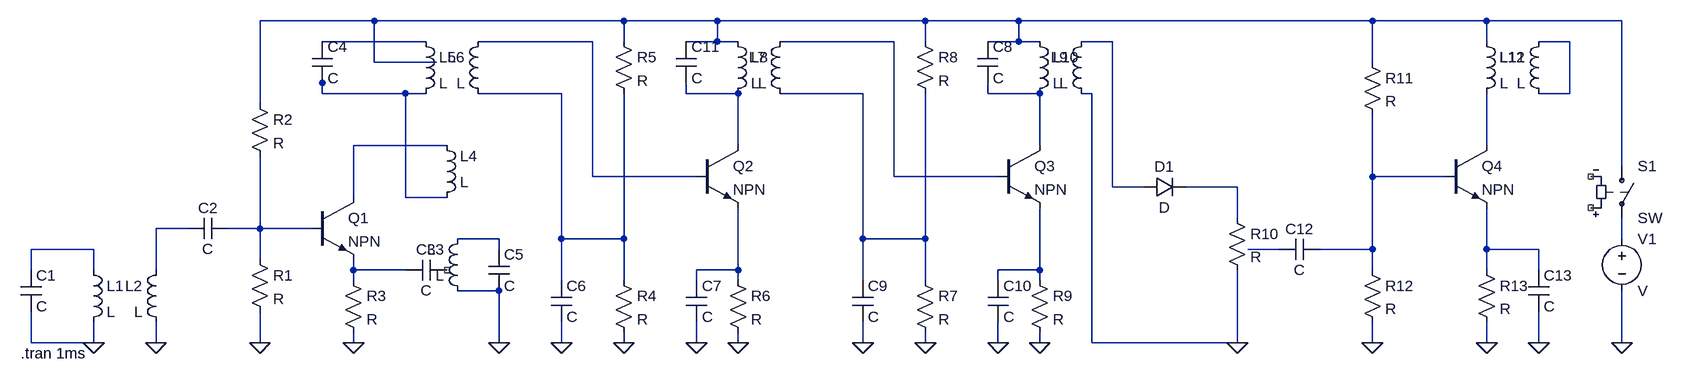
[diagram p0: schematic Superheterodyne Receiver Simulation.asc]
Superheterodyne Receiver Simulation.asc, the LTspice schematic file:
Version 4
SHEET 1 2528 680
WIRE 544 -304 368 -304
WIRE 928 -304 544 -304
WIRE 1072 -304 928 -304
WIRE 1392 -304 1072 -304
WIRE 1536 -304 1392 -304
WIRE 2080 -304 1536 -304
WIRE 2256 -304 2080 -304
WIRE 2464 -304 2256 -304
WIRE 624 -272 464 -272
WIRE 880 -272 704 -272
WIRE 928 -272 928 -304
WIRE 1072 -272 1072 -304
WIRE 1072 -272 1024 -272
WIRE 1104 -272 1072 -272
WIRE 1344 -272 1168 -272
WIRE 1392 -272 1392 -304
WIRE 1536 -272 1536 -304
WIRE 1536 -272 1488 -272
WIRE 1568 -272 1536 -272
WIRE 1680 -272 1632 -272
WIRE 2256 -272 2256 -304
WIRE 2384 -272 2336 -272
WIRE 544 -240 544 -304
WIRE 640 -240 544 -240
WIRE 2080 -240 2080 -304
WIRE 464 -208 464 -224
WIRE 464 -192 464 -208
WIRE 592 -192 464 -192
WIRE 624 -192 592 -192
WIRE 832 -192 704 -192
WIRE 1024 -192 1024 -208
WIRE 1104 -192 1024 -192
WIRE 1296 -192 1168 -192
WIRE 1488 -192 1488 -208
WIRE 1568 -192 1488 -192
WIRE 1648 -192 1632 -192
WIRE 2384 -192 2384 -272
WIRE 2384 -192 2336 -192
WIRE 368 -176 368 -304
WIRE 656 -112 512 -112
WIRE 1104 -112 1104 -192
WIRE 1568 -112 1568 -192
WIRE 2256 -112 2256 -192
WIRE 2464 -80 2464 -304
WIRE 880 -64 880 -272
WIRE 1040 -64 880 -64
WIRE 1344 -64 1344 -272
WIRE 1504 -64 1344 -64
WIRE 2080 -64 2080 -160
WIRE 2192 -64 2080 -64
WIRE 1680 -48 1680 -272
WIRE 1728 -48 1680 -48
WIRE 1872 -48 1792 -48
WIRE 512 -32 512 -112
WIRE 592 -32 592 -192
WIRE 656 -32 592 -32
WIRE 1872 0 1872 -48
WIRE 256 16 208 16
WIRE 368 16 368 -96
WIRE 368 16 320 16
WIRE 448 16 368 16
WIRE 736 32 672 32
WIRE 832 32 832 -192
WIRE 928 32 928 -192
WIRE 928 32 832 32
WIRE 1296 32 1296 -192
WIRE 1392 32 1392 -192
WIRE 1392 32 1296 32
WIRE 2464 32 2464 0
WIRE 112 48 16 48
WIRE 736 48 736 32
WIRE 1936 48 1888 48
WIRE 2080 48 2080 -64
WIRE 2080 48 2000 48
WIRE 2256 48 2256 -16
WIRE 2336 48 2256 48
WIRE 368 64 368 16
WIRE 16 80 16 48
WIRE 112 80 112 48
WIRE 208 80 208 16
WIRE 512 80 512 64
WIRE 592 80 512 80
WIRE 1104 80 1104 -16
WIRE 1104 80 1040 80
WIRE 1568 80 1568 -16
WIRE 1568 80 1504 80
WIRE 2080 80 2080 48
WIRE 2256 80 2256 48
WIRE 2336 80 2336 48
WIRE 512 96 512 80
WIRE 832 96 832 32
WIRE 928 96 928 32
WIRE 1040 96 1040 80
WIRE 1104 96 1104 80
WIRE 1296 96 1296 32
WIRE 1392 96 1392 32
WIRE 1504 96 1504 80
WIRE 1568 96 1568 80
WIRE 736 112 672 112
WIRE 16 192 16 144
WIRE 112 192 112 160
WIRE 112 192 16 192
WIRE 208 192 208 160
WIRE 368 192 368 144
WIRE 512 192 512 176
WIRE 736 192 736 112
WIRE 832 192 832 160
WIRE 928 192 928 176
WIRE 1040 192 1040 160
WIRE 1104 192 1104 176
WIRE 1296 192 1296 160
WIRE 1392 192 1392 176
WIRE 1504 192 1504 160
WIRE 1568 192 1568 176
WIRE 1648 192 1648 -192
WIRE 1872 192 1872 80
WIRE 1872 192 1648 192
WIRE 2080 192 2080 160
WIRE 2256 192 2256 160
WIRE 2336 192 2336 144
WIRE 2464 192 2464 112
FLAG 112 192 0
FLAG 208 192 0
FLAG 368 192 0
FLAG 512 192 0
FLAG 736 192 0
FLAG 832 192 0
FLAG 928 192 0
FLAG 1040 192 0
FLAG 1104 192 0
FLAG 1296 192 0
FLAG 1392 192 0
FLAG 1504 192 0
FLAG 1568 192 0
FLAG 1872 192 0
FLAG 2080 192 0
FLAG 2256 192 0
FLAG 2336 192 0
FLAG 2464 192 0
SYMBOL ind 96 64 R0
SYMATTR InstName L1
SYMBOL ind 224 64 M0
SYMATTR InstName L2
SYMBOL cap 0 80 R0
SYMATTR InstName C1
SYMBOL cap 320 0 R90
WINDOW 0 0 32 VBottom 2
WINDOW 3 32 32 VTop 2
SYMATTR InstName C2
SYMBOL res 352 48 R0
SYMATTR InstName R1
SYMBOL res 352 -192 R0
SYMATTR InstName R2
SYMBOL npn 448 -32 R0
SYMATTR InstName Q1
SYMBOL res 496 80 R0
SYMATTR InstName R3
SYMBOL cap 656 64 R90
WINDOW 0 0 32 VBottom 2
WINDOW 3 32 32 VTop 2
SYMATTR InstName C3
SYMBOL ind 688 128 R180
WINDOW 0 36 80 Left 2
WINDOW 3 36 40 Left 2
SYMATTR InstName L3
SYMBOL ind 640 -16 M180
WINDOW 0 36 80 Left 2
WINDOW 3 36 40 Left 2
SYMATTR InstName L4
SYMBOL ind 608 -288 R0
SYMATTR InstName L5
SYMBOL ind 720 -288 M0
SYMATTR InstName L6
SYMBOL cap 448 -272 R0
SYMATTR InstName C4
SYMBOL cap 720 48 R0
SYMATTR InstName C5
SYMBOL cap 816 96 R0
SYMATTR InstName C6
SYMBOL res 912 80 R0
SYMATTR InstName R4
SYMBOL res 912 -288 R0
SYMATTR InstName R5
SYMBOL npn 1040 -112 R0
SYMATTR InstName Q2
SYMBOL res 1088 80 R0
SYMATTR InstName R6
SYMBOL cap 1024 96 R0
SYMATTR InstName C7
SYMBOL ind 1184 -288 M0
SYMATTR InstName L7
SYMBOL cap 1280 96 R0
SYMATTR InstName C9
SYMBOL res 1376 80 R0
SYMATTR InstName R7
SYMBOL res 1376 -288 R0
SYMATTR InstName R8
SYMBOL npn 1504 -112 R0
SYMATTR InstName Q3
SYMBOL res 1552 80 R0
SYMATTR InstName R9
SYMBOL cap 1488 96 R0
SYMATTR InstName C10
SYMBOL ind 1088 -288 R0
SYMATTR InstName L8
SYMBOL cap 1008 -272 R0
SYMATTR InstName C11
SYMBOL ind 1648 -288 M0
SYMATTR InstName L9
SYMBOL ind 1552 -288 R0
SYMATTR InstName L10
SYMBOL cap 1472 -272 R0
SYMATTR InstName C8
SYMBOL diode 1728 -32 R270
WINDOW 0 32 32 VTop 2
WINDOW 3 0 32 VBottom 2
SYMATTR InstName D1
SYMBOL res 1856 -16 R0
SYMATTR InstName R10
SYMBOL cap 2000 32 R90
WINDOW 0 0 32 VBottom 2
WINDOW 3 32 32 VTop 2
SYMATTR InstName C12
SYMBOL res 2064 -256 R0
SYMATTR InstName R11
SYMBOL res 2064 64 R0
SYMATTR InstName R12
SYMBOL npn 2192 -112 R0
SYMATTR InstName Q4
SYMBOL ind 2240 -288 R0
SYMATTR InstName L11
SYMBOL ind 2352 -288 M0
SYMATTR InstName L12
SYMBOL res 2240 64 R0
SYMATTR InstName R13
SYMBOL cap 2320 80 R0
SYMATTR InstName C13
SYMBOL sw 2464 -96 R0
SYMATTR InstName S1
SYMBOL voltage 2464 16 R0
SYMATTR InstName V1
TEXT 0 208 Left 2 !.tran 1ms

The netlist it stands for:
* Superheterodyne Receiver Simulation.asc
L1 N020 0 L
L2 N016 0 L
C1 N020 0 C
C2 N017 N016 C
R1 N017 0 R
R2 N001 N017 R
Q1 N012 N017 N023 0 NPN
R3 N023 0 R
C3 NC_01 N023 C
L3 0 N018 L
L4 N007 N012 L
L5 N002 N007 L
L6 N003 N008 L
C4 N002 N007 C
C5 N018 0 C
C6 N008 0 C
R4 N008 0 R
R5 N001 N008 R
Q2 N009 N003 N024 0 NPN
R6 N024 0 R
C7 N024 0 C
L7 N004 N010 L
C9 N010 0 C
R7 N010 0 R
R8 N001 N010 R
Q3 N011 N004 N025 0 NPN
R9 N025 0 R
C10 N025 0 C
L8 N001 N009 L
C11 N001 N009 C
L9 N005 0 L
L10 N001 N011 L
C8 N001 N011 C
D1 N005 N015 D
R10 N015 0 R
C12 N014 N021 C
R11 N001 N014 R
R12 N014 0 R
Q4 N013 N014 N022 0 NPN
L11 N001 N013 L
L12 N006 N006 L
R13 N022 0 R
C13 N022 0 C
S1 N001 N019 NC_02 NC_03 SW
V1 N019 0 V
.model D D
.lib standard.dio
.model NPN NPN
.model PNP PNP
.lib standard.bjt
.tran 1ms
.backanno
.end